# EAGLE design LED Ring Dimmer (EAGLE 9.6.2)
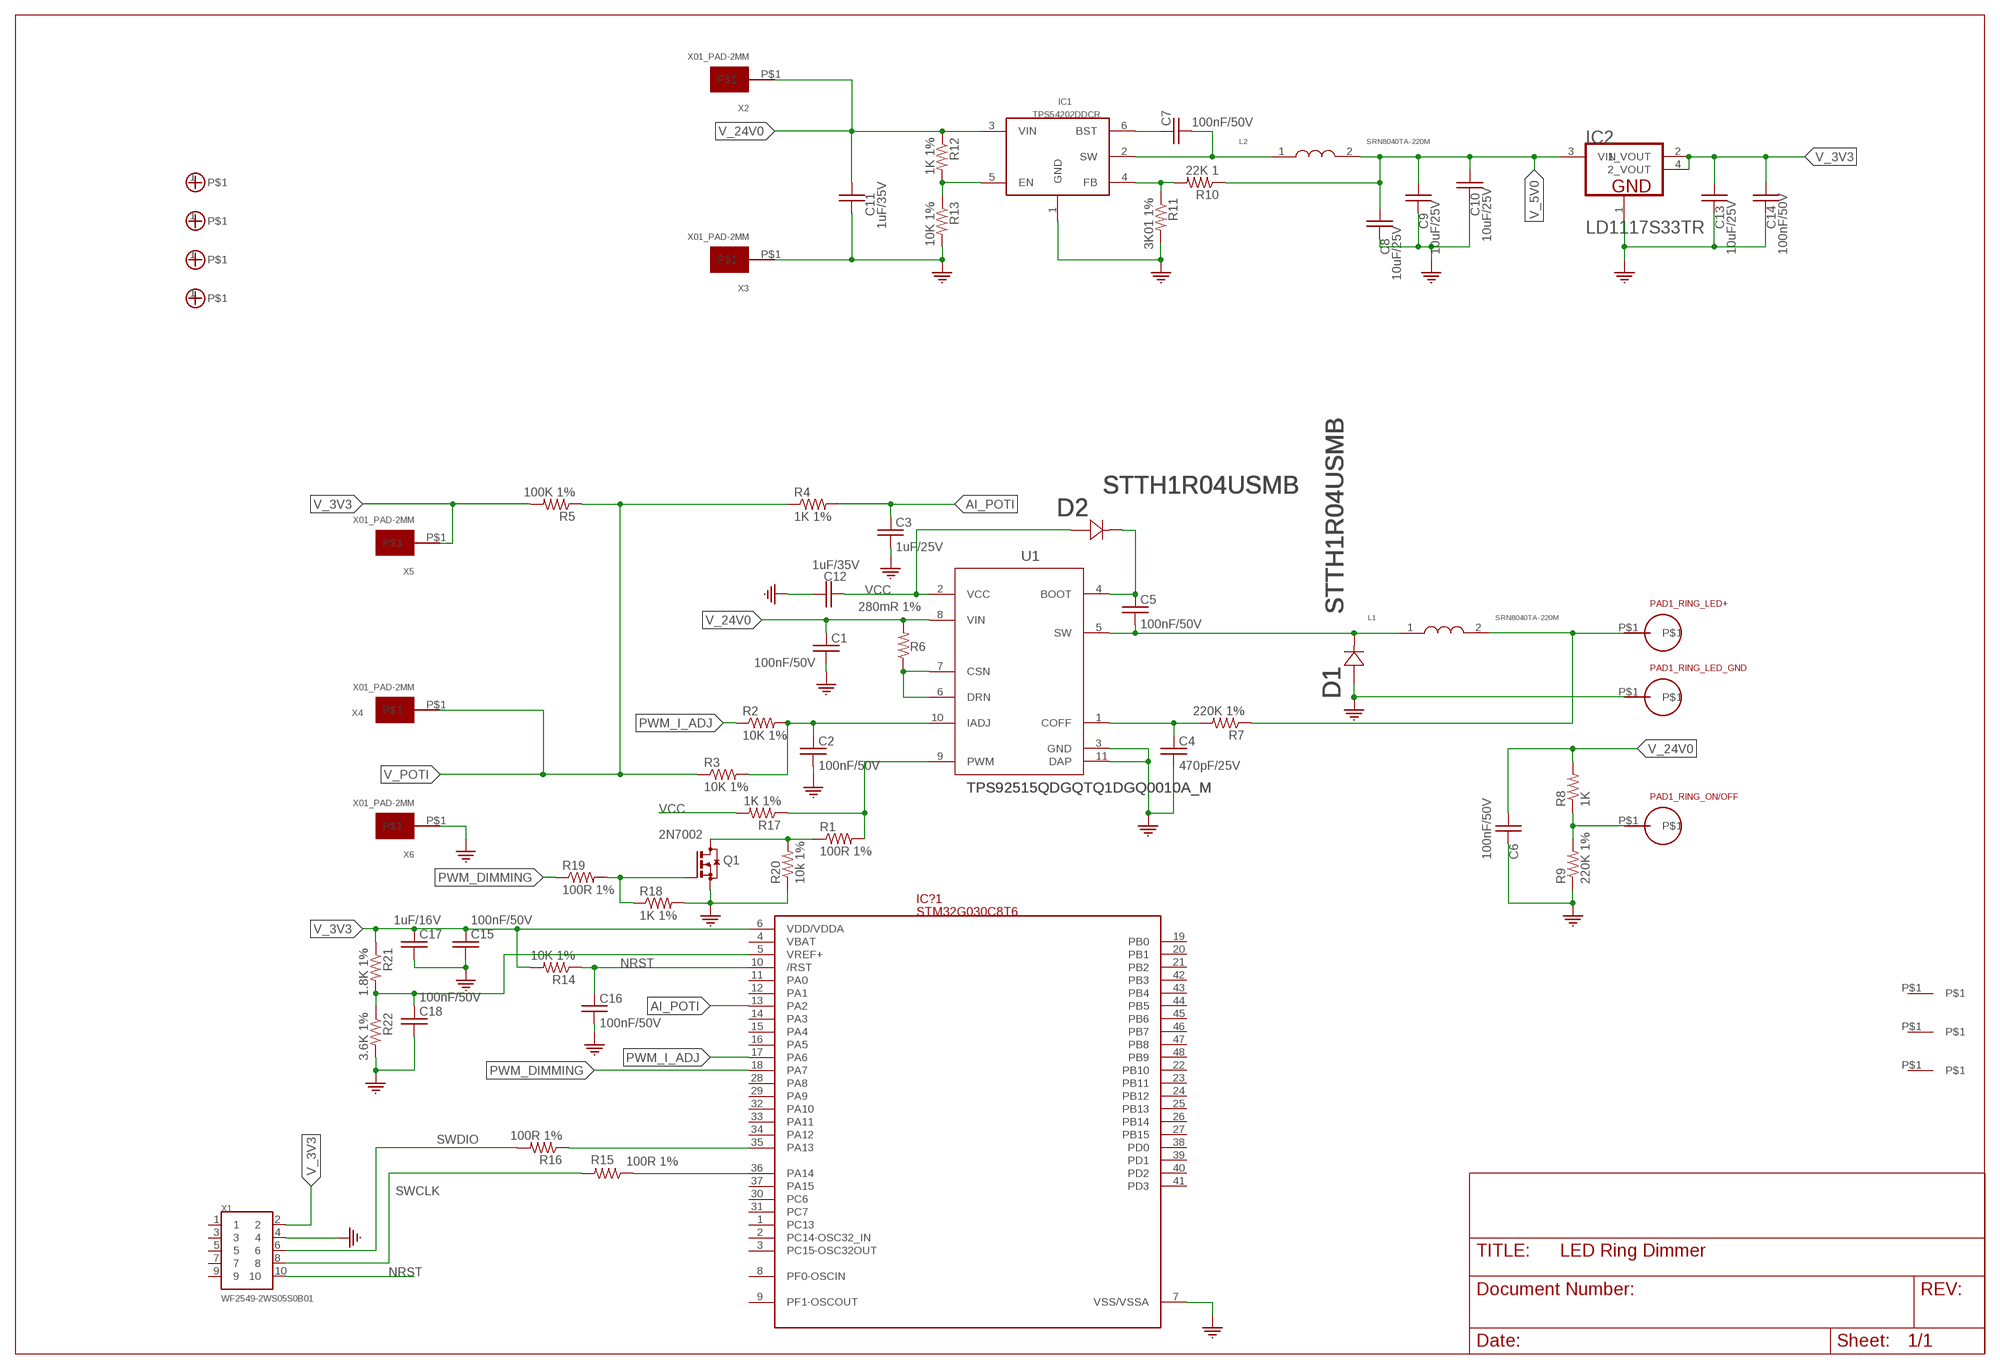
[diagram p0: schematic, sheet 1]

## Parts
C1  100nF/50V  C_0603EIA0603  [EIA0603]
C2  100nF/50V  C_0603EIA0603  [EIA0603]
C3  1uF/25V  C_0603EIA0603  [EIA0603]
C4  470pF/25V  C_0603EIA0603  [EIA0603]
C5  100nF/50V  C_0603EIA0603  [EIA0603]
C6  100nF/50V  C_0603EIA0603  [EIA0603]
C7  100nF/50V  C_0603EIA0603  [EIA0603]
C8  10uF/25V  C_0603EIA0603  [EIA0603]
C9  10uF/25V  C_0603EIA0603  [EIA0603]
C10  10uF/25V  C_0603EIA0603  [EIA0603]
C11  1uF/35V  C_0603EIA0603  [EIA0603]
C12  1uF/35V  C_0603EIA0603  [EIA0603]
C13  10uF/25V  C_0603EIA0603  [EIA0603]
C14  100nF/50V  C_0603EIA0603  [EIA0603]
C15  100nF/50V  C_0603EIA0603  [EIA0603]
C16  100nF/50V  C_0603EIA0603  [EIA0603]
C17  1uF/16V  C_0603EIA0603  [EIA0603]
C18  100nF/50V  C_0603EIA0603  [EIA0603]
D1  STTH1R04USMB  [SMB]
D2  STTH1R04USMB  [SMB]
FID1  FIDUCIAL  [FIDUCIAL]
FID2  FIDUCIAL  [FIDUCIAL]
FID3  FIDUCIAL  [FIDUCIAL]
IC1  TPS54202DDCR  [SOT23-6]
IC2  LD1117S33TR  [SOT223_LD1117S33TR]
IC?1  STM32G030C8T6  [LQFP48]
L1  SRN8040TA-220M  [SRN8040TA-220M]
L2  SRN8040TA-220M  [SRN8040TA-220M]
M1  M_HOLE_3M  [PCB_SCREW_M3_POWER]
M2  M_HOLE_3M  [PCB_SCREW_M3_POWER]
M3  M_HOLE_3M  [PCB_SCREW_M3_POWER]
M4  M_HOLE_3M  [PCB_SCREW_M3_POWER]
PAD1_RING_LED+  THT_PAD_5MM  [THT_PAD_D5.0]
PAD1_RING_LED_GND  THT_PAD_5MM  [THT_PAD_D5.0]
PAD1_RING_ON/OFF  THT_PAD_5MM  [THT_PAD_D5.0]
Q1  2N7002  [SOT23]
R1  100R 1%  R_0603  [EIA0603]
R2  10K 1%  R_0603  [EIA0603]
R3  10K 1%  R_0603  [EIA0603]
R4  1K 1%  R_0603  [EIA0603]
R5  100K 1%  R_0603  [EIA0603]
R6  280mR 1%  R_1206EIA1206  [EIA1206]
R7  220K 1%  R_0603  [EIA0603]
R8  1K  R_0603  [EIA0603]
R9  220K 1%  R_0603  [EIA0603]
R10  22K 1  R_0603  [EIA0603]
R11  3K01 1%  R_0603  [EIA0603]
R12  1K 1%  R_0603  [EIA0603]
R13  10K 1%  R_0603  [EIA0603]
R14  10K 1%  R_0603  [EIA0603]
R15  100R 1%  R_0603  [EIA0603]
R16  100R 1%  R_0603  [EIA0603]
R17  1K 1%  R_0603  [EIA0603]
R18  1K 1%  R_0603  [EIA0603]
R19  100R 1%  R_0603  [EIA0603]
R20  10k 1%  R_0603  [EIA0603]
R21  1.8K 1%  R_0603  [EIA0603]
R22  3.6K 1%  R_0603  [EIA0603]
U1  TPS92515QDGQTQ1DGQ0010A_M  [DGQ0010A_M]
X1  WF2549-2WS05S0B01  [X10_100MIL_2XROW_VERT]
X2  X01_PAD-2MM  [X01_PAD-2MM]
X3  X01_PAD-2MM  [X01_PAD-2MM]
X4  X01_PAD-2MM  [X01_PAD-2MM]
X5  X01_PAD-2MM  [X01_PAD-2MM]
X6  X01_PAD-2MM  [X01_PAD-2MM]

## Nets
AI_POTI: C3.1 IC?1.13(PA2) R4.2
GND: C1.2 C2.2 C3.2 C4.2 C6.2 C8.2 C9.2 C10.2 C11.2 C12.1 C13.2 C14.2 C15.2 C16.2 C17.2 C18.2 D1.A IC1.1(GND) IC2.1(GND) IC?1.7(VSS/VSSA) PAD1_RING_LED_GND.P$1 Q1.2(S) R9.1 R11.2 R13.2 R18.2 R20.1 R22.2 U1.3(GND) U1.11(DAP) X1.4 X3.P$1 X6.P$1
N$1: C1.1 R6.2 U1.8(VIN)
N$2: C5.2 D1.K(C) L1.1 U1.5(SW)
N$3: R6.1 U1.6(DRN) U1.7(CSN)
N$4: C2.1 R2.2 R3.2 U1.10(IADJ)
N$5: C4.1 R7.2 U1.1(COFF)
N$6: R1.2 R17.1 U1.9(PWM)
N$7: L1.2 PAD1_RING_LED+.P$1 R7.1
N$8: C5.1 D2.K(C) U1.4(BOOT)
N$9: PAD1_RING_ON/OFF.P$1 R8.1 R9.2
N$10: C7.1 IC1.6(BST)
N$11: C7.2 IC1.2(SW) L2.1
N$12: IC1.4(FB) R10.2 R11.1
N$13: Q1.3(D) R1.1 R20.2
N$14: IC1.5(EN) R12.2 R13.1
N$15: Q1.1(G) R18.1 R19.2
N$16: C18.1 IC?1.5(VREF+) R21.2 R22.1
N$17: IC?1.35(PA13) R16.1
N$18: IC?1.36(PA14) R15.1
NRST: C16.1 IC?1.10(/RST) R14.1 X1.10
PWM_DIMMING: IC?1.18(PA7) R19.1
PWM_I_ADJ: IC?1.17(PA6) R2.1
SWCLK: R15.2 X1.8
SWDIO: R16.2 X1.6
V_3V3: C13.1 C14.1 C15.1 C17.1 IC2.2(1_VOUT) IC2.4(2_VOUT) IC?1.6(VDD/VDDA) R5.2 R14.2 R21.1 X1.2 X5.P$1
V_5V0: C8.1 C9.1 C10.1 IC2.3(VIN) L2.2 R10.1
V_24V0: C6.1 C11.1 IC1.3(VIN) R8.2 R12.1 X2.P$1
V_POTI: R3.1 R4.1 R5.1 X4.P$1
VCC: C12.2 D2.A R17.2 U1.2(VCC)
Unconnected: FID1.P$1 FID2.P$1 FID3.P$1 IC?1.1(PC13) IC?1.2(PC14-OSC32_IN) IC?1.3(PC15-OSC32OUT) IC?1.4(VBAT) IC?1.8(PF0-OSCIN) IC?1.9(PF1-OSCOUT) IC?1.11(PA0) IC?1.12(PA1) IC?1.14(PA3) IC?1.15(PA4) IC?1.16(PA5) IC?1.19(PB0) IC?1.20(PB1) IC?1.21(PB2) IC?1.22(PB10) IC?1.23(PB11) IC?1.24(PB12) IC?1.25(PB13) IC?1.26(PB14) IC?1.27(PB15) IC?1.28(PA8) IC?1.29(PA9) IC?1.30(PC6) IC?1.31(PC7) IC?1.32(PA10) IC?1.33(PA11) IC?1.34(PA12) IC?1.37(PA15) IC?1.38(PD0) IC?1.39(PD1) IC?1.40(PD2) IC?1.41(PD3) IC?1.42(PB3) IC?1.43(PB4) IC?1.44(PB5) IC?1.45(PB6) IC?1.46(PB7) IC?1.47(PB8) IC?1.48(PB9) M1.1 M2.1 M3.1 M4.1 X1.1 X1.3 X1.5 X1.7 X1.9

## Library data of the parts
C1-C18 = Labops_Lib_AH:C_0603
D1 D2 = Labops_Lib_AH:STTH1R04U; DESCRIPTION: 1A, 400V, SMB, Fast Recovery; MFN: STTH1R04U; PART_VALUE: STTH1R04U
FID1-FID3 = Labops_Lib_AH:FIDUCIAL
IC1 = Labops_Lib_AH:TPS54202DDCR; DESCRIPTION: 2A 28V SOT-23-6 Sync Buck; LIB_STATUS: Prototype; MFN: TPS54202DDCR; MFR: Texas Instruments; OUR_STOCK: 40; PART_VALUE: TPS54202; PRICE-1: 1.8; SUPPLIER-1: LCSC
IC2 = Labops_Lib_AH:LD1117S33TR: IC REG LINEAR 3.3V 800mA SOT223; DESCRIPTION: LDO,Fixed 15V 3.3V 1.3V @ 800mA SOT-223; LIB_STATUS: Verified; MFN: LD1117S33TR; MFR: STmicro, Diodes, TI,; OUR_STOCK: 10; PART_VALUE: xx1117x33xx; PRICE-1: 0.07; SUPPLIER-1: LCSC
IC?1 = Labops_Lib_AH:STM32G030C8T6
L1 L2 = Labops_Lib_AH:SRN8040TA-220M: FIXED IND 22UH 2.9A SMD, 73m-Ohm, Bourns; DESCRIPTION: FIXED IND 22UH 2.9A SMD, 73m-Ohm, Bourns; LIB_STATUS: Verified; MFN: SRN8040TA-220M; MFR: Bourns; OUR_STOCK: 10; PART_VALUE: 22uH/2.9A; SUPPLIER-1: Digikey; TECHNOLOGY: SMD
M1-M4 = Labops_Lib_AH:M_HOLE_3M
PAD1_RING_LED+ PAD1_RING_LED_GND PAD1_RING_ON/OFF = Labops_Lib_AH:THT_PAD_5MM
Q1 = Labops_Lib_AH:2N7002; DESCRIPTION: NMOSFET, 500mA, 60V, Vth 2.5V; LIB_STATUS: Prototype; MFN: 2N7002; MFR: Diodes, Guangdong Hotetech,NXP; OUR_STOCK: 100; PART_VALUE: NMOSFET; PRICE-1: 0.02; SUPPLIER-1: LCSC
R1-R5 R7-R22 = Labops_Lib_AH:R_0603; MFN: Open Source 0603
R6 = Labops_Lib_AH:R_1206; MFN: Open Source R1206
U1 = Labops_Lib_AH:TPS92515QDGQTQ1; COPYRIGHT: Copyright (C) 2023 Ultra Librarian. All rights reserved.; DESCRIPTION: LED Driver 2A, 42V, Buck, Analog and PWM Dimming,MSOP-PowerPad-10; MFN: TPS92515QDGQTQ1; MFR: Texas Instruments; PART_VALUE: TPS92515; REFDES: RefDes; TYPE: TYPE
X1 = Labops_Lib_AH:WF2549-2WS05S0B01; DESCRIPTION: X10, 10 Pins, Header, Pitch 2.54 wire to board 2xrows, THT; MFN: WF2549-2WS05S0B01; MFR: WCON; PRICE-1: 0.25; SUPPLIER-1: LCSC
X2-X6 = Labops_Lib_AH:X01_PAD-2MM

## Net classes
5 LV: width 0.203 mm, clearance 7 mm to class 1, clearance 7 mm to class 2, clearance 7 mm to class 3, clearance 7 mm to class 4, clearance 0.203 mm

## Board
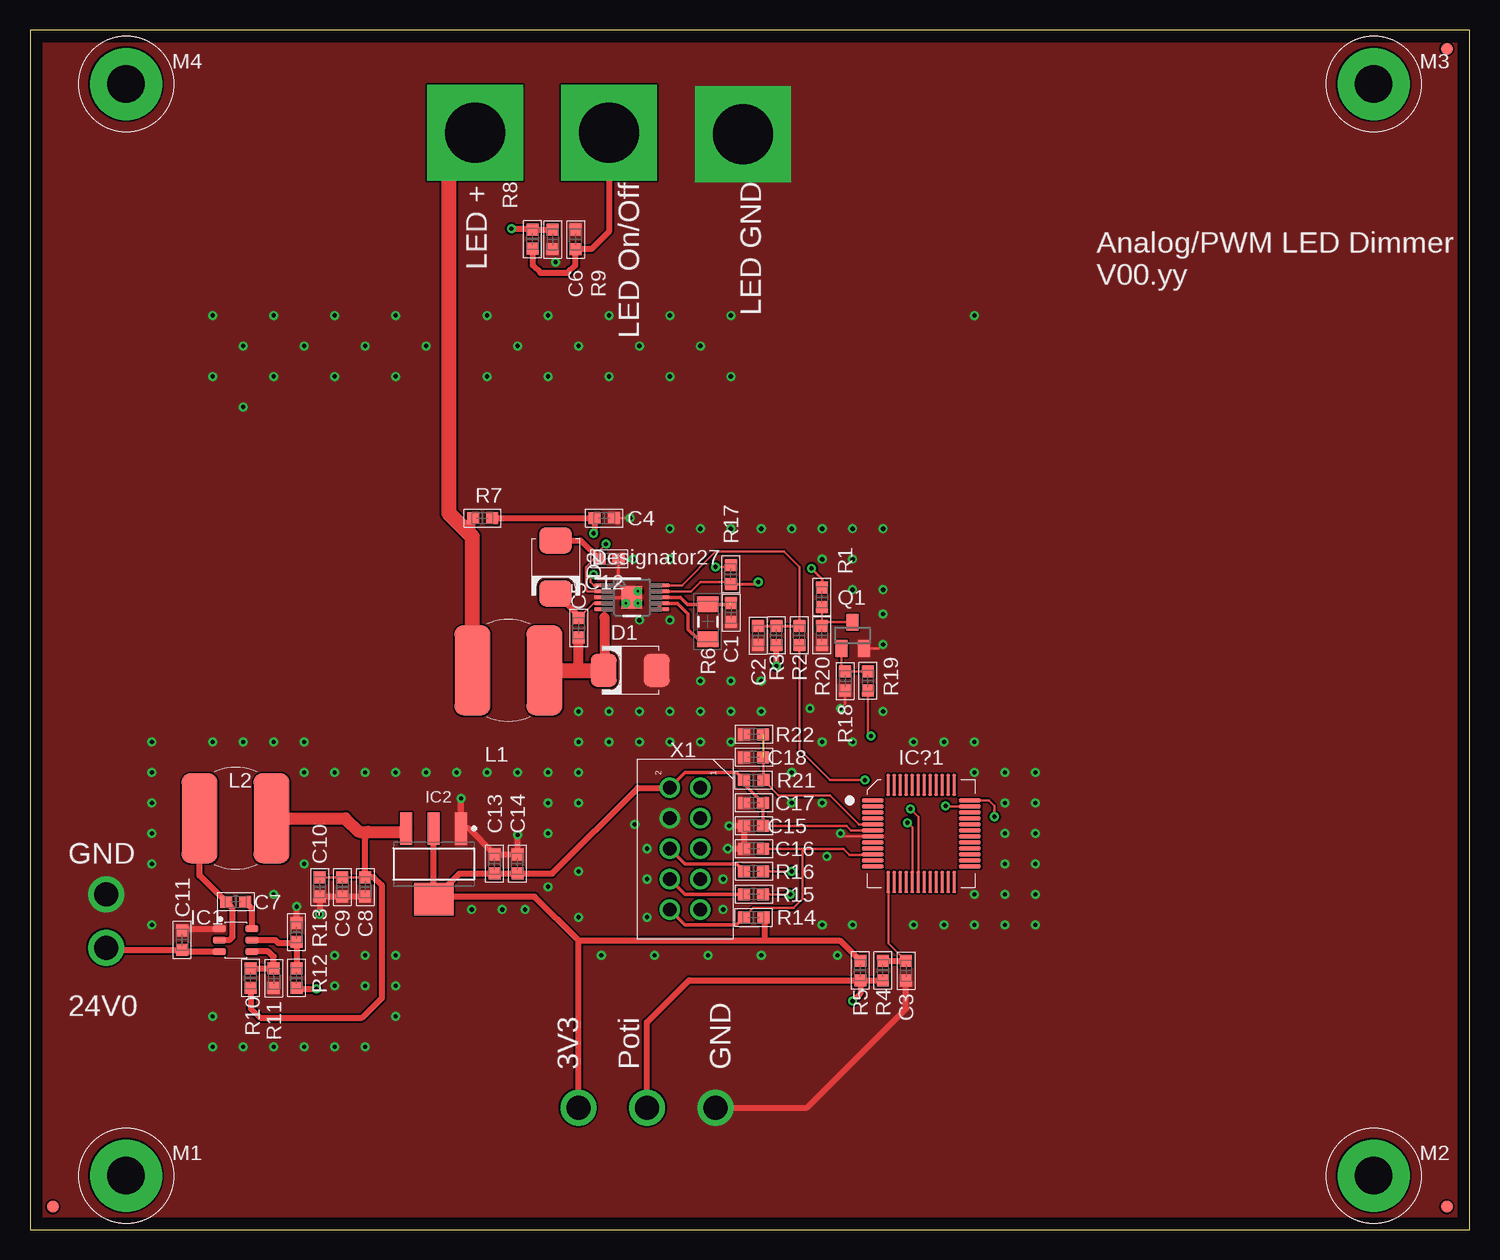
[diagram p1: board, top side]
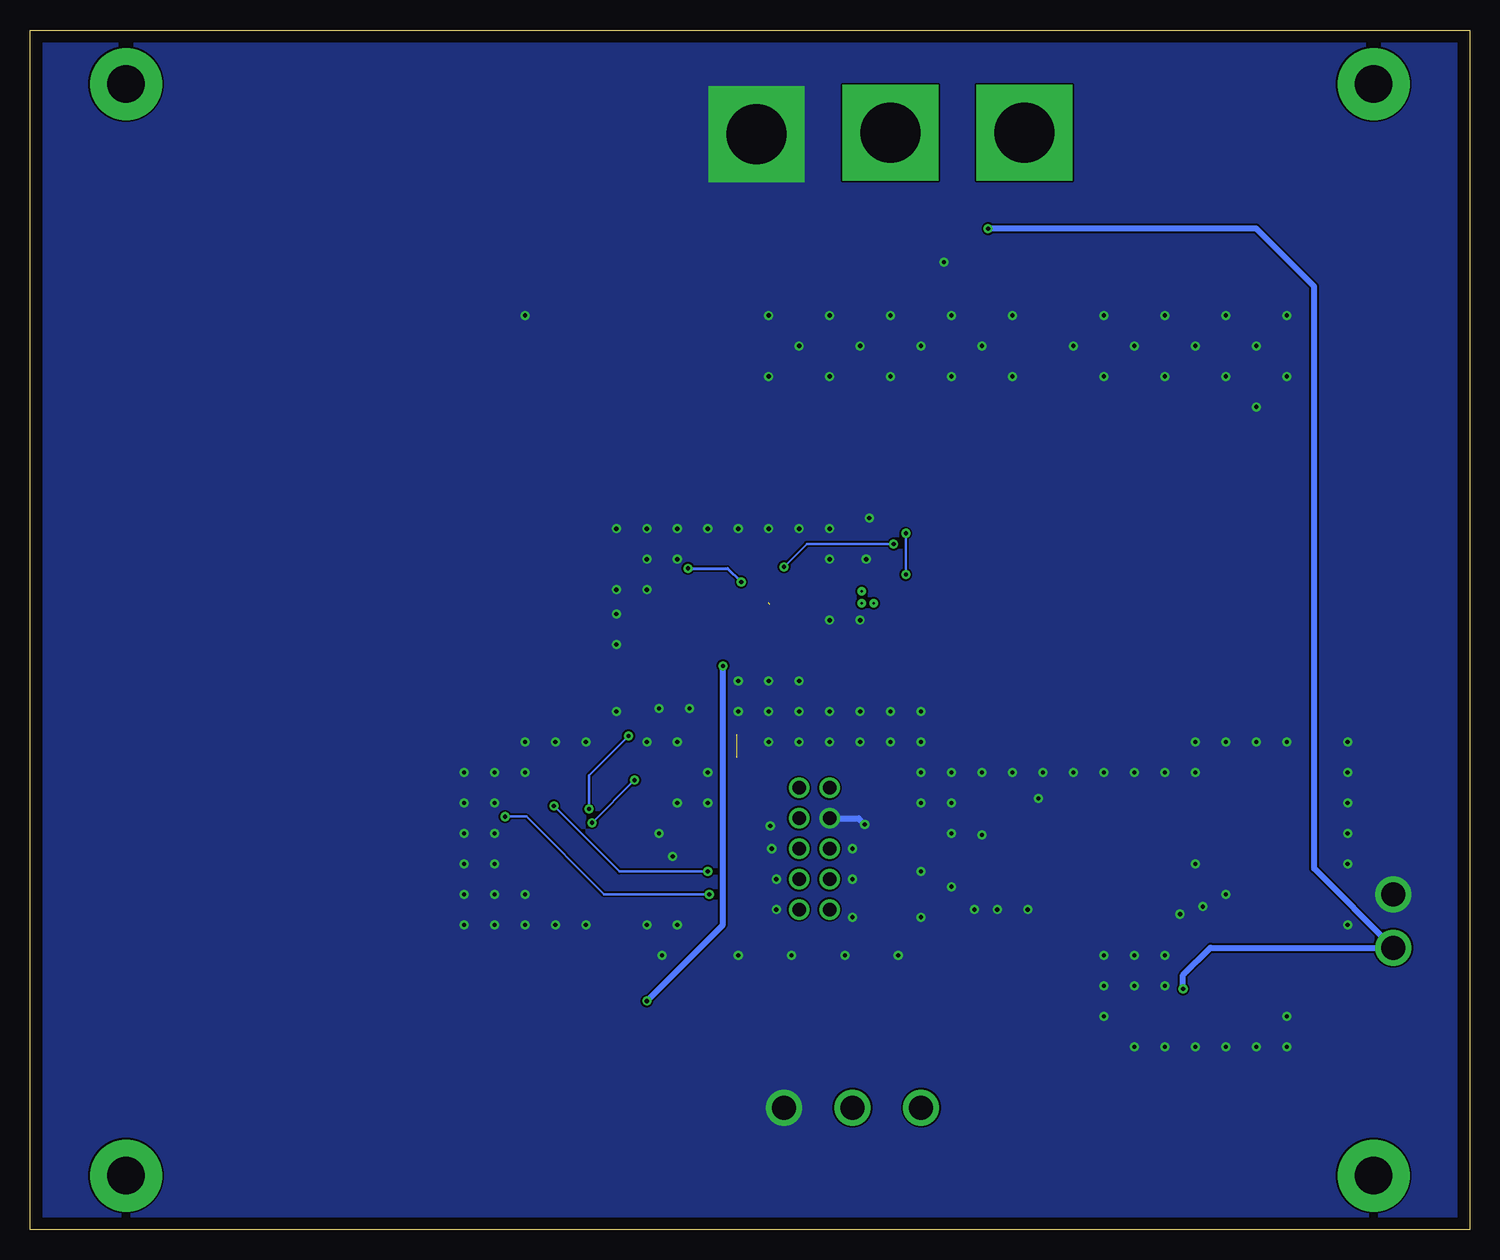
[diagram p2: board, bottom side, seen from below]

Size 120 x 100 mm. Coordinates in mm from the lower left corner, seen from the top.
Outline: 0,0 120,0 120,100 0,100 0,0
Copper layers (1*16): Top 0.035mm / dielectric 1.5mm / Bottom 0.035mm
Design rules "default *": minimum track width 6mil, minimum drill 0.35mm, track to track 6mil, track to pad 6mil, pad to pad 6mil, via to via 6mil, smd to smd 6mil, copper to edge 40mil, drill to drill 6mil, minimum pad ring 10mil, minimum via ring 8mil, stop-mask expansion 4mil, vias tented up to drill 20mil, thermal gap 10mil

### Footprints (pad centres in the part's own frame; a part is rotated, then mirrored left to right if it is on the bottom)
EIA0603 = smd 1 x 1: 1 -0.8,0; 2 0.8,0
SMB = smd 2.16 x 2.74: A -2.21,0; K 2.21,0
FIDUCIAL = smd 1 x 1: P$1 0,0
SOT23-6 = smd 0.6 x 1.1: 1 -0.95,-1.35; 2 0,-1.35; 3 0.95,-1.35; 4 0.95,1.35; 5 0,1.35; 6 -0.95,1.35
SOT223_LD1117S33TR = smd 2.7 x 1: 1 -2.95,2.3; 2 -2.95,0; 3 -2.95,-2.3 | smd 2.7 x 3.3: 4 2.95,0
LQFP48 = smd 1.8 x 0.3: 1 -4.05,2.75; 2 -4.05,2.25; 3 -4.05,1.75; 4 -4.05,1.25; 5 -4.05,0.75; 6 -4.05,0.25; 7 -4.05,-0.25; 8 -4.05,-0.75; 9 -4.05,-1.25; 10 -4.05,-1.75; 11 -4.05,-2.25; 12 -4.05,-2.75; 25 4.05,-2.75; 26 4.05,-2.25; 27 4.05,-1.75; 28 4.05,-1.25; 29 4.05,-0.75; 30 4.05,-0.25; 31 4.05,0.25; 32 4.05,0.75; 33 4.05,1.25; 34 4.05,1.75; 35 4.05,2.25; 36 4.05,2.75 | smd 0.3 x 1.8: 13 -2.75,-4.05; 14 -2.25,-4.05; 15 -1.75,-4.05; 16 -1.25,-4.05; 17 -0.75,-4.05; 18 -0.25,-4.05; 19 0.25,-4.05; 20 0.75,-4.05; 21 1.25,-4.05; 22 1.75,-4.05; 23 2.25,-4.05; 24 2.75,-4.05; 37 2.75,4.05; 38 2.25,4.05; 39 1.75,4.05; 40 1.25,4.05; 41 0.75,4.05; 42 0.25,4.05; 43 -0.25,4.05; 44 -0.75,4.05; 45 -1.25,4.05; 46 -1.75,4.05; 47 -2.25,4.05; 48 -2.75,4.05
SRN8040TA-220M = smd 3 x 7.5: 1 -3,0; 2 3,0
PCB_SCREW_M3_POWER = drill 3.1 pad 6: 1 0,0
THT_PAD_D5.0 = drill 5 pad 8 square: P$1 0,0
SOT23 = smd 1 x 1.4: 1 -0.95,-1.1; 2 0.95,-1.1; 3 0,1.1
EIA1206 = smd 1.3 x 1.8: 1 -1.45,0; 2 1.45,0
DGQ0010A_M = smd 1.55 x 0.3: 1 -2.325,1; 2 -2.325,0.5; 3 -2.325,0; 4 -2.325,-0.5; 5 -2.325,-1; 6 2.325,-1; 7 2.325,-0.5; 8 2.325,0; 9 2.325,0.5; 10 2.325,1 | smd 1.73 x 1.9: 11 0,0 | drill 0.203 pad 0.5: V_1 0.5,0.5; V_2 -0.5,-0.5; V_3 0.5,-0.5
X10_100MIL_2XROW_VERT = drill 1.1 pad 1.7: 1 -5.08,1.27; 2 -5.08,-1.27; 3 -2.54,1.27; 4 -2.54,-1.27; 5 0,1.27; 6 0,-1.27; 7 2.54,1.27; 8 2.54,-1.27; 9 5.08,1.27; 10 5.08,-1.27
X01_PAD-2MM = drill 2: P$1 0,0

### Placement (x,y rotation side)
C1  58.42,51.44 270 top
C2  60.71,49.53 270 top
C3  73.03,21.59 270 top
C4  47.88,59.31 0 top
C5  45.72,50.16 270 top
C6  43.56,82.55 270 top
C7  17.14,27.3 180 top
C8  27.94,28.57 270 top
C9  26.04,28.57 270 top
C10  24.13,28.57 270 top
C11  12.7,24.13 90 top
C12  48.26,55.88 180 top
C13  38.73,30.48 90 top
C14  40.64,30.48 90 top
C15  60.33,33.66 180 top
C16  60.33,31.75 180 top
C17  60.33,35.56 180 top
C18  60.33,39.37 180 top
D1  50.04,46.61 180 top
D2  43.81,55.24 270 top
FID1  1.91,1.91 0 top
FID2  118.11,98.42 0 top
FID3  118.11,1.91 0 top
IC1  17.14,24.13 270 top
IC2  33.66,30.48 270 top
IC?1  74.3,33.02 0 top
L1  39.88,46.61 180 top
L2  17.14,34.29 0 top
M1  8,4.5 0 top
M2  112,4.5 0 top
M3  112,95.5 0 top
M4  8,95.5 0 top
PAD1_RING_LED+  37.08,91.44 0 top
PAD1_RING_LED_GND  59.44,91.31 0 top
PAD1_RING_ON/OFF  48.26,91.44 0 top
Q1  68.58,49.53 0 top
R1  66.04,52.7 90 top
R2  64.14,49.53 90 top
R3  62.23,49.53 90 top
R4  71.12,21.59 90 top
R5  69.22,21.59 90 top
R6  56.52,50.67 90 top
R7  37.72,59.31 0 top
R8  41.91,82.55 90 top
R9  45.47,82.55 270 top
R10  18.41,20.95 90 top
R11  20.32,20.95 270 top
R12  22.23,20.95 90 top
R13  22.23,24.77 90 top
R14  60.33,26.04 0 top
R15  60.33,27.94 180 top
R16  60.33,29.84 180 top
R17  58.42,54.61 90 top
R18  67.94,45.72 270 top
R19  69.85,45.72 90 top
R20  66.04,49.53 90 top
R21  60.33,37.47 0 top
R22  60.33,41.27 180 top
U1  50.16,52.7 0 top
X1  54.61,31.75 270 top
X2  6.35,23.5 0 top
X3  6.35,27.94 0 top
X4  51.44,10.16 0 top
X5  45.72,10.16 0 top
X6  57.15,10.16 0 top

### Tracks (layer width: path | path; a pad name or v marks a point on that pad's centre or on a via)
AI_POTI
  Top 0.203: C3.1 71.55,23.87 IC?1.13
  Top 0.508: R4.2 C3.1 | C3.1
GND  (via drill 0.35)
  Top 0.203: IC?1.7 67.81,32.77 v67.56,33.02 | Q1.2 70.78,48.43 v71.12,48.77 | C4.2 v50.04,59.31 | C12.1 v50.29,55.88 | R18.2 67.94,43.81 v67.56,43.43
  Top 0.254: U1.3 49.27,52.7 49.4,52.84 | U1.11 49.06,53.81 C12.1
  Top 0.508: C11.2 12.85,25.08 IC1.1 | X6.P$1 64.77,10.16 73.03,18.41 C3.2 | IC2.1 36.59,33.43 C13.2 C14.2 v40.64,32.89 | C8.2 C10.2 v24.13,26.29 | R13.2 v22.23,26.92 | IC2.1 35.95,35.94 | IC2.1 35.94,33.44 v35.94,35.94 | v58.29,33.66 C15.2 C16.2 v58.17,31.75
  Bottom 0.508: X1.4 50.93,34.29 v50.42,33.78
  other vias: 43.81,80.64 78.74,76.2 15.24,76.2 20.32,76.2 25.4,76.2 30.48,76.2 33.02,73.66 27.94,73.66 22.86,73.66 17.78,73.66 15.24,71.12 20.32,71.12 25.4,71.12 30.48,71.12 38.1,76.2 43.18,76.2 48.26,76.2 53.34,76.2 58.42,76.2 40.64,73.66 45.72,73.66 50.8,73.66 55.88,73.66 58.42,71.12 53.34,71.12 48.26,71.12 43.18,71.12 38.1,71.12 17.78,68.58 60.96,58.42 55.88,58.42 66.04,58.42 71.12,58.42 71.12,53.34 71.12,43.18 65.02,43.43 60.96,43.18 60.96,45.72 55.88,45.72 55.88,43.18 55.88,40.64 53.34,50.8 53.34,43.18 50.8,43.18 48.26,43.18 45.72,43.18 53.34,40.64 50.8,40.64 48.26,40.64 45.72,40.64 58.42,43.18 58.42,40.64 58.42,45.72 50.8,50.8 53.34,55.88 53.34,58.42 58.42,58.42 63.5,58.42 68.58,58.42 68.58,55.88 66.04,55.88 68.58,53.34 71.12,51.31 63.5,38.1 66.04,40.64 68.58,40.64 73.66,40.64 76.2,40.64 78.74,40.64 78.74,38.1 81.28,38.1 81.28,35.56 81.28,33.02 81.28,30.48 81.28,27.94 78.74,27.94 76.2,25.4 78.74,25.4 81.28,25.4 73.66,25.4 68.58,25.4 66.04,25.4 83.82,38.1 83.82,35.56 83.82,33.02 83.82,30.48 83.82,27.94 83.82,25.4 66.04,35.56 63.5,35.56 45.72,38.1 45.72,35.56 43.18,35.56 43.18,33.02 43.18,38.1 40.64,38.1 38.1,38.1 35.56,38.1 33.02,38.1 30.48,38.1 27.94,38.1 25.4,38.1 20.32,27.94 10.16,30.48 10.16,33.02 10.16,35.56 10.16,38.1 10.16,40.64 15.24,40.64 17.78,40.64 20.32,40.64 22.86,40.64 22.86,38.1 22.86,30.48 30.48,22.86 30.48,20.32 30.48,17.78 27.94,15.24 27.94,20.32 25.4,20.32 25.4,22.86 27.94,22.86 25.4,15.24 22.86,15.24 20.32,15.24 17.78,15.24 15.24,17.78 15.24,15.24 10.16,25.4 43.18,28.57 45.72,29.84 45.72,26.04 39.37,26.67 41.27,26.67 36.83,26.67 67.31,22.86 47.62,22.86 52.07,22.86 56.52,22.86 60.96,22.86 57.78,29.21 57.78,26.67 51.44,26.04 51.44,29.21 51.44,31.75 66.42,31.11
  pour Top (no thermals): 0,0 0,99.95 120.02,99.95 120.02,0
  pour Bottom (no thermals): 0,0 0,99.95 120.02,99.95 120.02,0
N$1  (1 unrouted)
  Top 0.203: C1.1 58.47,52.28 | 56.52,52.11 R6.2
  Top 0.305: U1.8 54.23,52.7 54.83,52.11 56.52,52.11 | R6.2 58.31,52.12
N$2
  Top 0.203: 47.88,51.05 47.88,51.67 U1.5
  Top 0.813: 45.72,46.61 C5.2 | 47.88,51.05 47.88,46.66 D1.K
  Top 1.27: L1.1 45.72,46.61 D1.K
N$3
  Top 0.305: U1.6 U1.7 53.97,52.2 54.86,51.31 54.86,50.04 55.68,49.22 R6.1
N$4
  Top 0.203: U1.10 54.34,53.7 57.15,56.52 62.87,56.52 64.14,55.24 R2.2 62.36,50.33 R3.2
  Top 0.254: C2.1 62.36,50.33 | 62.36,50.33 | R3.2 R2.2
N$5  (via drill 0.35)
  Top 0.203: U1.1 47.01,53.7 46.74,53.98 46.74,54.48 46.86,54.61 v46.99,54.61
  Top 0.508: R7.2 C4.1 47.08,58.13 v46.99,58.04
  Bottom 0.203: v46.99,54.61 v46.99,58.04
N$6  (via drill 0.35)
  Top 0.203: U1.9 55.11,53.2 55.88,53.98 58.26,53.98 R17.1
  Top 0.254: R17.1 60.54,53.81 v60.71,53.98 | v65.15,55.12 66.04,54.23 R1.2
  Bottom 0.254: v60.71,53.98 61.85,55.12 v65.15,55.12
N$7
  Top 0.508: L1.2 36.88,59.27 R7.1
  Top 1.27: L1.2 36.88,57.74 34.92,59.69 34.92,89.28 PAD1_RING_LED+.P$1
N$8
  Top 0.203: C5.1 46.96,52.2 U1.4
  Top 0.508: D2.K 45.72,51.13 C5.1
N$9
  Top 0.508: R8.1 41.91,80.39 42.55,79.76 44.83,79.76 45.47,80.39 R9.2 46.83,81.75 48.26,83.19 PAD1_RING_ON/OFF.P$1
N$10
  Top 0.508: C7.1 18.5,26.75 IC1.6
N$11
  Top 0.508: IC1.2 16.64,24.13 16.89,24.38 16.89,26.76 C7.2 14.14,29.5 L2.1
N$12
  Top 0.508: R11.1 20.32,22.73 19.87,23.18 IC1.4 | R10.2 R11.1 | R11.1
N$13
  Top 0.203: R1.1 R20.2 66.34,50.63 Q1.3
N$14
  Top 0.508: IC1.5 20.45,24.13 20.7,23.88 22.14,23.88 R13.1 R12.2
N$15
  Top 0.203: Q1.1 67.63,46.84 R18.1 R19.2 | R19.2
N$16  (1 unrouted)
  Top 0.203: IC?1.5 69.1,33.77 66.67,36.2 62.4,36.2 R21.2 | R21.2 | R21.2 R22.1 | R22.1
N$17  (via drill 0.35)
  Top 0.203: R16.1 v63.5,29.84 | v76.33,35.31 76.36,35.27 IC?1.35
  Bottom 0.203: v63.5,29.84 70.87,29.84 v76.33,35.31
N$18  (via drill 0.35)
  Top 0.203: R15.1 v63.37,27.94 | v80.39,34.42 80.39,35.31 79.93,35.77 IC?1.36
  Bottom 0.203: v63.37,27.94 72.14,27.94 78.61,34.42 v80.39,34.42
NRST
  Top 0.203: C16.1 64.39,31.75 | 64.39,31.75 67.82,31.75 68.33,31.24 70.22,31.24 IC?1.10 | R14.1 60.29,26.8 63.63,26.8 64.39,27.56 64.39,31.75
  Top 0.305: X1.10 54.61,25.4 58.89,25.4 R14.1
PWM_DIMMING  (via drill 0.35)
  Top 0.203: IC?1.18 74.05,34.41 v73.41,35.05 | v70.1,41.15 69.85,41.4 R19.1
  Bottom 0.203: v73.41,35.05 73.41,37.85 v70.1,41.15
PWM_I_ADJ  (via drill 0.35)
  Top 0.203: R2.1 64.14,40.01 66.67,37.47 v69.6,37.47 | v73.15,33.91 73.55,33.52 IC?1.17
  Bottom 0.203: v73.15,33.91 v69.6,37.47
SWCLK
  Top 0.305: X1.8 54.61,27.94 R15.2
SWDIO
  Top 0.305: X1.6 54.61,30.48 58.89,30.48 R16.2
V_3V3
  Top 0.203: C15.1 68.07,33.66 68.46,33.27 IC?1.6
  Top 0.305: X1.2 54.61,38.1 58.89,38.1 R21.1 59.52,37.16 C17.1 C15.1
  Top 0.508: IC2.2 IC2.4 33.86,27.73 | 33.86,27.73 35.8,29.68 C13.1 C14.1 43.52,29.68 50.67,36.83 X1.2 | X5.P$1 45.72,24.09 | 45.72,24.09 61.21,24.09 | 61.21,24.09 67.51,24.09 R5.2 | R14.2 61.21,25.95 61.21,24.09 | 45.72,24.09 42.08,27.73 33.86,27.73
V_5V0
  Top 0.203: C10.1 C9.1 C8.1
  Top 0.508: R10.1 18.41,18.41 19.18,17.65 27.69,17.65 29.34,19.3 29.34,28.7 28.66,29.38 C8.1 27.94,32.64 27.43,33.15
  Top 1.016: L2.2 26.29,34.29 27.43,33.15 28.19,33.15 31.07,33.15 IC2.3
V_24V0  (via drill 0.35)
  Top 0.508: X2.P$1 6.51,23.33 C11.1 12.85,23.18 IC1.3 | R12.1 22.31,20.07 v23.88,20.07 | v40.13,83.44 41.82,83.44 R8.2 C6.1 | C6.1
  Bottom 0.508: v23.88,20.07 23.88,21.21 21.59,23.5 X2.P$1 12.95,30.1 12.95,78.61 17.78,83.44 v40.13,83.44
V_POTI  (via drill 0.35)
  Top 0.508: X4.P$1 51.44,17.27 54.95,20.79 R5.1 | R5.1 R4.1 | R5.1 69.22,19.68 v68.58,19.05 | v62.23,46.99 R3.1
  Bottom 0.508: v68.58,19.05 62.23,25.4 v62.23,46.99
VCC  (via drill 0.35)
  Top 0.203: U1.2 46.49,53.2 46.35,53.34 46.35,55.24 46.99,55.88 C12.2 47.46,56.6 v48.01,57.15 | v57.15,55.24 58.26,55.24 R17.2
  Top 0.508: D2.A 45.88,57.45 C12.2
  Bottom 0.203: v48.01,57.15 55.24,57.15 v57.15,55.24

### Text on the board
tPlace: LED + | Analog/PWM LED Dimmer / V00.yy | LED GND | LED On/Off | GND | 24V0 | 3V3 | Poti | GND